# Altium schematic sheet Actuadores.SchDoc: Actuadores
size A4; CompanyName: MUISE; Engineer: Manuel Viqueira Rodríguez; Organization: ETSI Telecomunicaciones; Address1: Av. Complutense, 30; Address2: , 28040 Madrid; Address3: Madrid; Address4: España; DocumentNumber: 6; Revision: V1.0; SheetNumber: 6; SheetTotal: 8; Engineer2: Marcos Vázquez Núñez
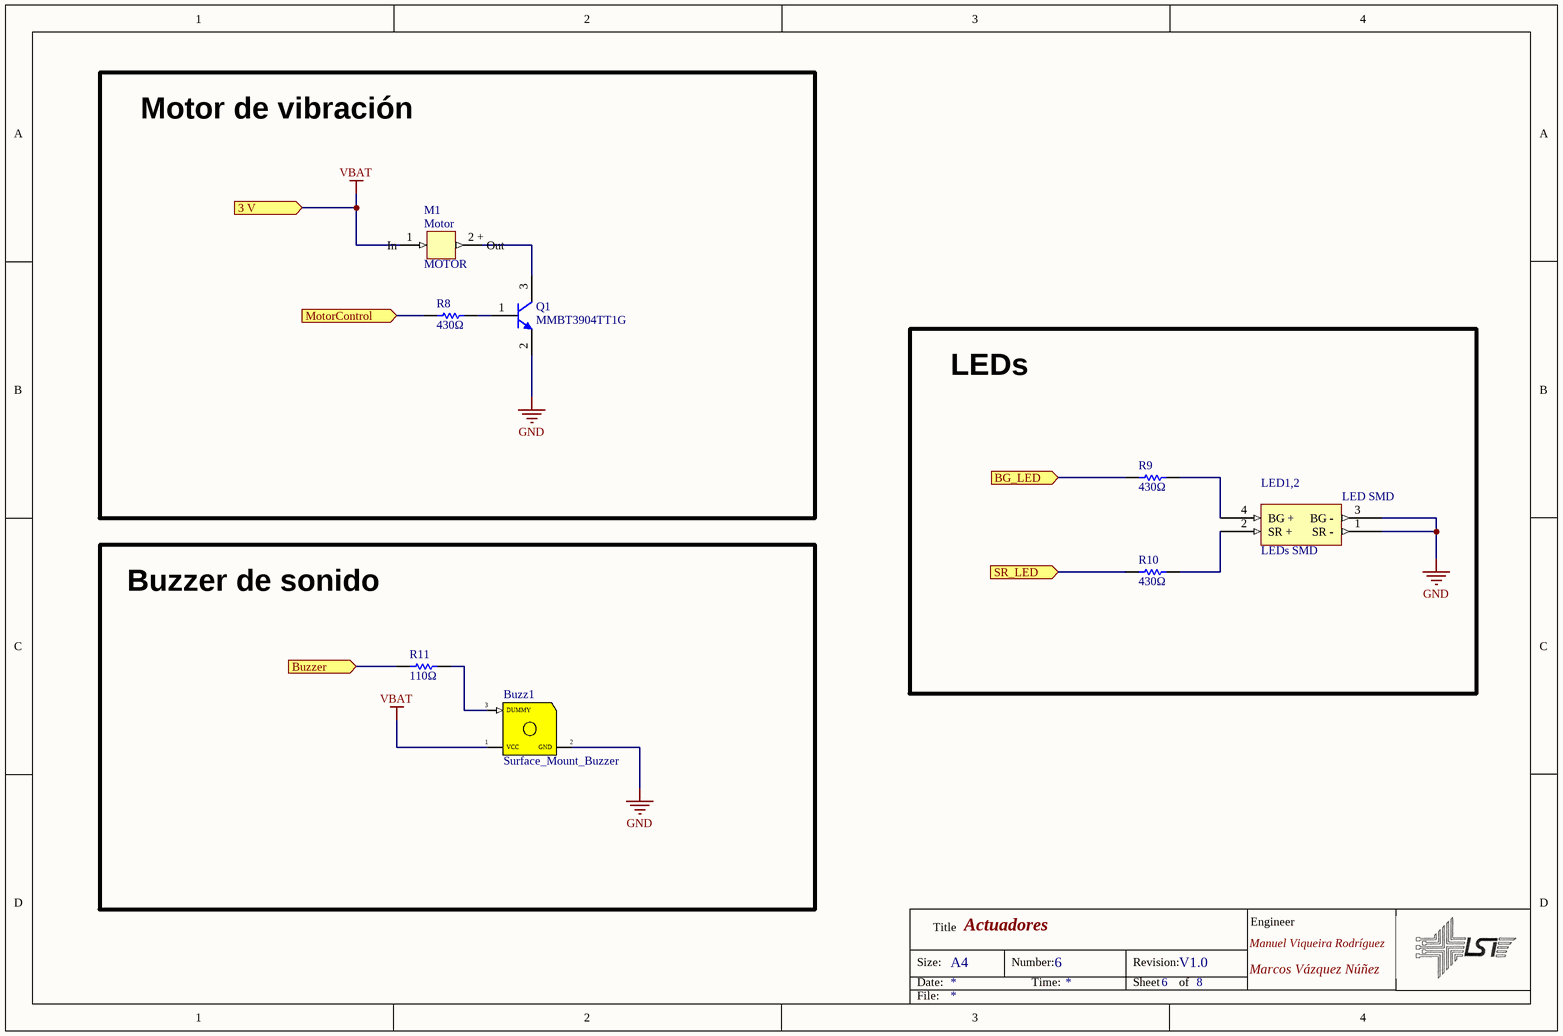
[diagram p0: Actuadores.SchDoc]

## Parts
Buzz1  Surface_Mount_Buzzer  [buzzer]
LED1,2  LEDs SMD  [LED_SMD]
M1  MOTOR  [Motor]
Q1  MMBT3904TT1G  [ONSC-SC-75-3-463-01_V]
R8  430Ω  [RESC1005X40X25NL05T10]
R9  430Ω  [RESC1005X40X25NL05T10]
R10  430Ω  [RESC1005X40X25NL05T10]
R11  110Ω  [RESC1005X40X25NL05T10]

## Blocks framed on the sheet
Motor de vibración: M1 Q1 R8
LEDs: LED1,2 R9 R10
Buzzer de sonido: Buzz1 R11

## Ports
3 V (in), BG_LED (in), Buzzer (in), MotorControl (in), SR_LED (in)

## Nets
GND: Buzz1.2(GND) LED1,2.1(SR_-) LED1,2.3(BG_-) Q1.2(E)
VBAT: Buzz1.1(VCC) M1.1(In) ; port 3 V
BG_LED: R9.1 ; port BG_LED
Buzzer: R11.1 ; port Buzzer
MotorControl: R8.1 ; port MotorControl
SR_LED: R10.1 ; port SR_LED
NetBuzz1_3: Buzz1.3(DUMMY) R11.2
NetLED1,2_2: LED1,2.2(SR_+) R10.2
NetLED1,2_4: LED1,2.4(BG_+) R9.2
NetM1_2 +: M1.2_+(Out) Q1.3(C)
NetQ1_1: Q1.1(B) R8.2

## Notes on the sheet
- Size:
- Date:
- Title
- A4
- Number:
- Time:
- Revision:
- Sheet
- of
- Engineer
- File:
- (in symbol LED) LED SMD
- (in symbol MOTOR) Motor

## Library data of the parts
LED1,2 = LED
Q1 = CMP-1048-00420-1: General Purpose Transistor, NPN Silicon, 3-Pin SC-75, Pb-Free, Tape and Reel; Manufacturer: On Semiconductor; IC Continuous (A): 0.2; fT Min (MHz): 300; ComponentLink3URL: http://www.onsemi.com/pub_link/Collateral/463-01.PDF; DatasheetVersion: Rev. 5; RoHS: TRUE; Mounting Technology: Surface Mount; ComponentLink1URL: http://www.onsemi.com/; ComponentLink3Description: Package Specification; PackageReference: SC-75-3-463-01; Polarity: NPN; ComponentLink2Description: Datasheet; PackageVersion: Rev. F, 07/2005; PartNumber: MMBT3904TT1G; ComponentLink2URL: http://www.onsemi.cn/pub_link/Collateral/MMBT3904TT1-D.PDF; ComponentLink1Description: Manufacturer URL; PackageDescription: 3-Pin Small Outline Transistor, Body 1.6 x 0.8 mm, Pitch 0.5 mm; Packing: Tape and Reel
R8-R11 = CMP-2002-06462-1: Part Number: ERJ-U02F1501X; Manufacturer: Panasonic